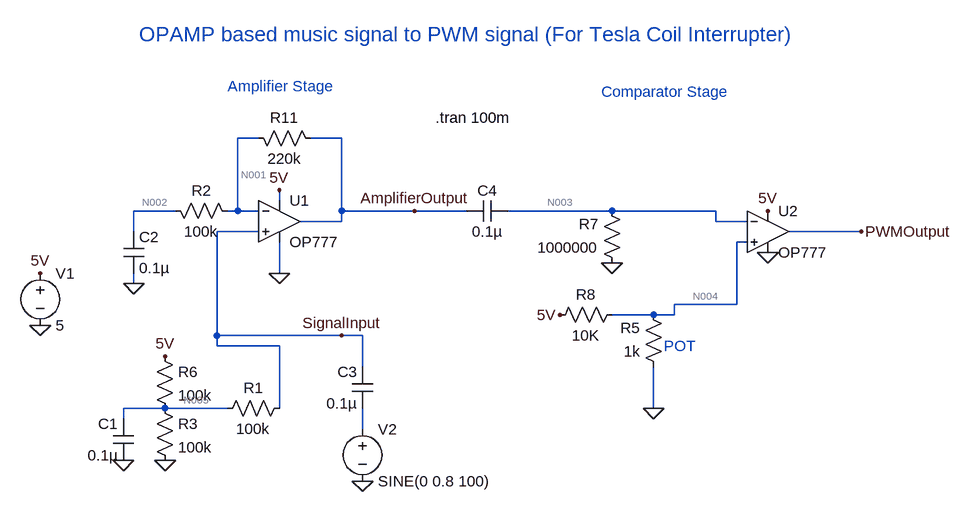
[diagram p0: schematic MusicSignaltoPWM.asc]
MusicSignaltoPWM.asc, the LTspice schematic file:
Version 4
SHEET 1 1100 680
WIRE 16 0 -16 0
WIRE 144 0 96 0
WIRE 48 96 48 80
WIRE -112 112 -176 112
WIRE -16 112 -16 0
WIRE -16 112 -32 112
WIRE 16 112 -16 112
WIRE 144 112 144 0
WIRE 256 112 144 112
WIRE 336 112 256 112
WIRE 560 112 400 112
WIRE 720 112 560 112
WIRE 144 128 144 112
WIRE 144 128 80 128
WIRE 720 128 720 112
WIRE 768 128 720 128
WIRE -176 144 -176 112
WIRE 16 144 -48 144
WIRE 944 144 832 144
WIRE 768 160 752 160
WIRE 48 208 48 160
WIRE -176 224 -176 208
WIRE 752 256 752 160
WIRE 752 256 656 256
WIRE 624 272 560 272
WIRE 656 272 656 256
WIRE 656 272 624 272
WIRE -48 304 -48 144
WIRE 144 304 -48 304
WIRE 176 304 144 304
WIRE -48 320 -48 304
WIRE 48 320 -48 320
WIRE 176 352 176 304
WIRE -128 416 -192 416
WIRE -32 416 -128 416
WIRE 48 416 48 320
WIRE 624 416 624 352
WIRE -192 432 -192 416
WIRE 176 448 176 416
FLAG 48 80 5V
FLAG -320 288 0
FLAG -320 208 5V
FLAG 176 528 0
FLAG -128 496 0
FLAG 48 208 0
FLAG -176 224 0
FLAG -128 336 5V
FLAG -192 496 0
FLAG 624 416 0
FLAG 800 176 0
FLAG 800 112 5V
FLAG 944 144 PWMOutput
FLAG 560 192 0
FLAG 480 272 5V
FLAG 256 112 AmplifierOutput
FLAG 144 304 SignalInput
SYMBOL voltage -320 192 R0
WINDOW 123 0 0 Left 0
WINDOW 39 0 0 Left 0
SYMATTR InstName V1
SYMATTR Value 5
SYMBOL res 0 -16 M90
WINDOW 0 0 56 VBottom 2
WINDOW 3 32 56 VTop 2
SYMATTR InstName R11
SYMATTR Value 220k
SYMBOL res -16 128 M270
WINDOW 0 32 56 VTop 2
WINDOW 3 0 56 VBottom 2
SYMATTR InstName R2
SYMATTR Value 100k
SYMBOL voltage 176 432 R0
WINDOW 123 0 0 Left 0
WINDOW 39 0 0 Left 0
SYMATTR InstName V2
SYMATTR Value SINE(0 0.8 100)
SYMBOL OpAmps\\OP777 48 64 R0
SYMATTR InstName U1
SYMBOL cap -176 496 R180
WINDOW 0 24 56 Left 2
WINDOW 3 24 8 Left 2
SYMATTR InstName C1
SYMATTR Value 0.1µ
SYMBOL res -144 400 R0
SYMATTR InstName R3
SYMATTR Value 100k
SYMBOL res -144 320 R0
SYMATTR InstName R6
SYMATTR Value 100k
SYMBOL cap -192 144 R0
SYMATTR InstName C2
SYMATTR Value 0.1µ
SYMBOL res 64 400 R90
WINDOW 0 0 56 VBottom 2
WINDOW 3 32 56 VTop 2
SYMATTR InstName R1
SYMATTR Value 100k
SYMBOL cap 192 416 R180
WINDOW 0 24 56 Left 2
WINDOW 3 24 8 Left 2
SYMATTR InstName C3
SYMATTR Value 0.1µ
SYMBOL OpAmps\\OP777 800 80 R0
SYMATTR InstName U2
SYMBOL res 640 368 R180
WINDOW 0 36 76 Left 2
WINDOW 3 36 40 Left 2
SYMATTR InstName R5
SYMATTR Value 1k
SYMBOL res 576 208 R180
WINDOW 0 36 76 Left 2
WINDOW 3 36 40 Left 2
SYMATTR InstName R7
SYMATTR Value 1000000
SYMBOL cap 400 96 R90
WINDOW 0 0 32 VBottom 2
WINDOW 3 32 32 VTop 2
SYMATTR InstName C4
SYMATTR Value 0.1µ
SYMBOL res 576 256 R90
WINDOW 0 0 56 VBottom 2
WINDOW 3 32 56 VTop 2
SYMATTR InstName R8
SYMATTR Value 10K
TEXT 288 -32 Left 2 !.tran 100m
TEXT 640 320 Left 2 ;POT
TEXT -168 -160 Left 3 ;OPAMP based music signal to PWM signal (For Tesla Coil Interrupter)
TEXT -32 -80 Left 2 ;Amplifier Stage
TEXT 544 -72 Left 2 ;Comparator Stage

The netlist it stands for:
* MusicSignaltoPWM.asc
V1 5V 0 5
R11 N001 AmplifierOutput 220k
R2 N001 N002 100k
V2 N006 0 SINE(0 0.8 100)
XU1 SignalInput N001 5V 0 AmplifierOutput OP777  ; pins In+ In- V+ V- OUT
C1 0 N005 0.1µ
R3 N005 0 100k
R6 5V N005 100k
C2 N002 0 0.1µ
R1 SignalInput N005 100k
C3 N006 SignalInput 0.1µ
XU2 N004 N003 5V 0 PWMOutput OP777  ; pins In+ In- V+ V- OUT
R5 0 N004 1k
R7 0 N003 1000000
C4 N003 AmplifierOutput 0.1µ
R8 N004 5V 10K
.tran 100m
* POT
* OPAMP based music signal to PWM signal (For Tesla Coil Interrupter)
* Amplifier Stage
* Comparator Stage
.lib ADI.lib
.backanno
.end

* Results of the author's LTspice run, read from the files saved beside the schematic
* Operating Point, zero values left out:
*   V(5v) = 5 V
*   V(n001) = 2.502 V
*   V(amplifieroutput) = 2.5 V
*   V(n002) = 2.502 V
*   V(signalinput) = 2.502 V
*   V(n005) = 2.501 V
*   V(n003) = 34.57 mV
*   V(n004) = 454.5 mV
*   V(pwmoutput) = 5 V
*   I(R11) = 9.801 nA
*   I(R3) = 25.01 µA
*   I(R6) = 24.99 µA
*   I(R1) = 11.8 nA
*   I(R5) = -454.5 µA
*   I(R7) = -34.57 nA
*   I(R8) = -454.5 µA
*   I(V1) = -759.3 µA
*   Ix(u1:1) = -11.8 nA
*   Ix(u1:2) = -9.801 nA
*   Ix(u1:99) = 216.8 µA
*   Ix(u1:50) = -216.8 µA
*   Ix(u1:45) = 9.8 nA
*   Ix(u2:1) = -999.7 pA
*   Ix(u2:2) = -34.58 nA
*   Ix(u2:99) = 63 µA
*   Ix(u2:50) = -62.96 µA
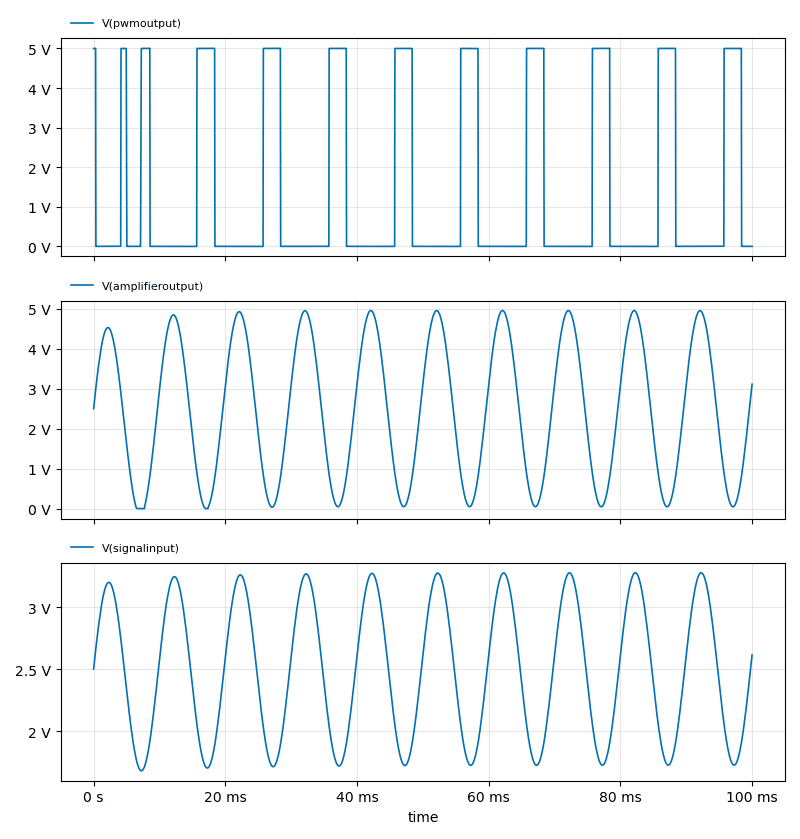
[diagram p1: Transient Analysis of MusicSignaltoPWM.asc, plotted from the saved traces]
* Transient Analysis, 1 run:
*   V(pwmoutput): min -1.992 mV, max 5.003 V, average 1.325 V, rms 2.568 V, last 0 V
*   V(amplifieroutput): min 1.685 mV, max 4.954 V, average 2.462 V, rms 3.005 V, last 3.114 V
*   V(signalinput): min 1.681 V, max 3.276 V, average 2.489 V, rms 2.549 V, last 2.614 V